# Altium schematic sheet not_sure_yet.SchDoc
size A4
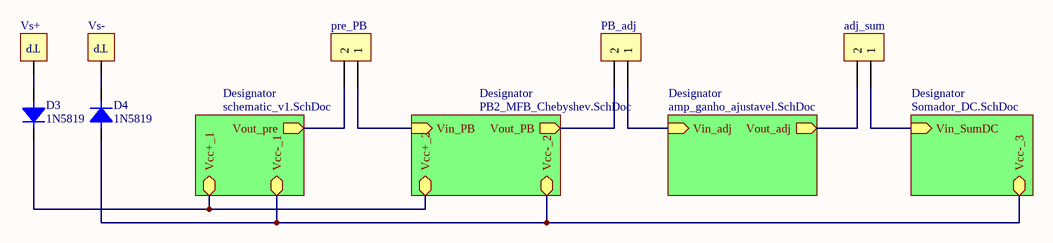
[diagram p0: not_sure_yet.SchDoc]

## Parts
adj_sum  Header_1x2  [HDR-M-1x2-2.54mm-180-9.2mm]  (value not drawn)
D3  1N5819  [DO-41-Plastic]
D4  1N5819  [DO-41-Plastic]
PB_adj  Header_1x2  [HDR-M-1x2-2.54mm-180-9.2mm]  (value not drawn)
pre_PB  Header_1x2  [HDR-M-1x2-2.54mm-180-9.2mm]  (value not drawn)
Vs+  TestPoint  [TEST_POINT_PTH]  (value not drawn)
Vs-  TestPoint  [TEST_POINT_PTH]  (value not drawn)

## Sub-sheets
Designator = schematic_v1.SchDoc: Vout_pre (out), Vcc+_1, Vcc-_1
Designator = PB2_MFB_Chebyshev.SchDoc: Vin_PB (in), Vout_PB (out), Vcc+_2, Vcc-_2
Designator = Somador_DC.SchDoc: Vin_SumDC (in), Vcc-_3
Designator = amp_ganho_ajustavel.SchDoc: Vin_adj (in), Vout_adj (out)

## Nets
Netadj_sum_1: adj_sum.1 ; sheet Designator/Vin_SumDC
Netadj_sum_2: adj_sum.2 ; sheet Designator/Vout_adj
NetD3_A: D3.A Vs+.1(TP)
NetD3_K: D3.K ; sheet Designator/Vcc+_1, sheet Designator/Vcc+_2
NetD4_A: D4.A ; sheet Designator/Vcc-_1, sheet Designator/Vcc-_2, sheet Designator/Vcc-_3
NetD4_K: D4.K Vs-.1(TP)
NetPB_adj_1: PB_adj.1 ; sheet Designator/Vin_adj
NetPB_adj_2: PB_adj.2 ; sheet Designator/Vout_PB
Netpre_PB_1: pre_PB.1 ; sheet Designator/Vin_PB
Netpre_PB_2: pre_PB.2 ; sheet Designator/Vout_pre

## Library data of the parts
adj_sum PB_adj pre_PB = Header_1x2: Header, 1 Line, 2 Columns, 2 Pins; LatestRevisionDate: 17-Jul-2002; LatestRevisionNote: Re-released for DXP Platform.; Publisher: Altium Limited
D3 D4 = 1N4007: General Purpose Rectifier; Peak Repetitive Reverse Voltage (Vrrm): 1000 V; Forward Current (If): 1 A; Non-Repetitive Peak Forward Surge Current (Ifsm): 30 A; Forward Voltage (Vf): 1.1 V; Reverse Current (Ir): 5 uA; Total Capacitance (Ct): 15 pF
Vs+ Vs- = TestPoint: Test Point